# Altium schematic sheet Level_Shifter.SchDoc
size A; DrawnBy: TIMKEN; SheetNumber: 3; SheetTotal: 7
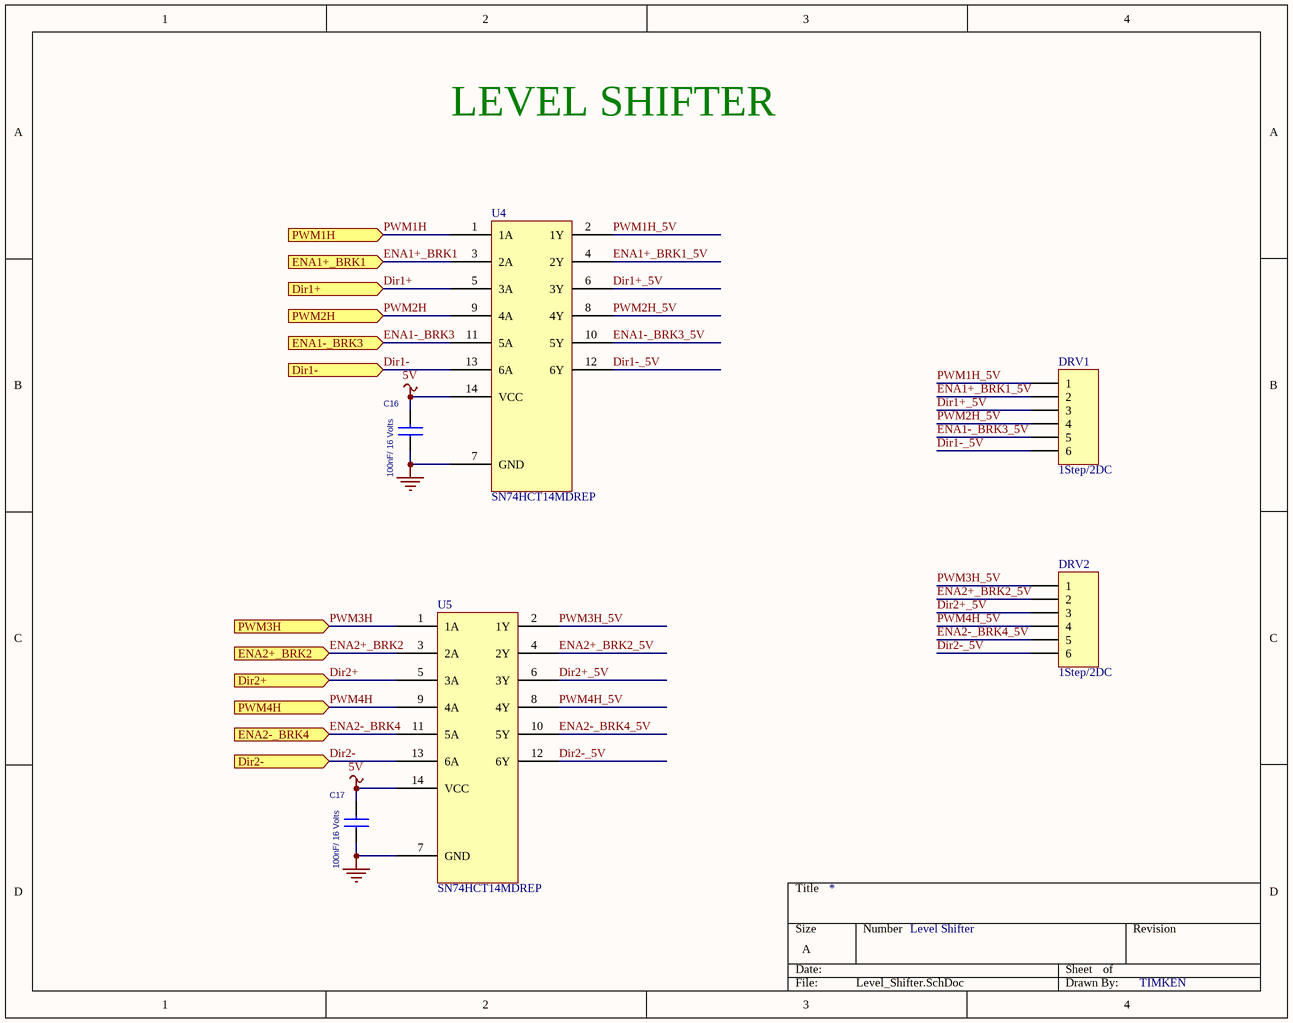
[diagram p0: Level_Shifter.SchDoc]

## Parts
C16  100nF/ 16 Volts  [CAP_CERAMIC]
C17  100nF/ 16 Volts  [CAP_CERAMIC]
DRV1  1Step/2DC  [1x6_single]
DRV2  1Step/2DC  [1x6_single]
U4  SN74HCT14MDREP  [SN74HCT14MDREP]
U5  SN74HCT14MDREP  [SN74HCT14MDREP]

## Ports
Dir1+ (in), Dir1- (in), Dir2+ (in), Dir2- (in), ENA1+_BRK1 (in), ENA1-_BRK3 (in), ENA2+_BRK2 (in), ENA2-_BRK4 (in), PWM1H (in), PWM2H (in), PWM3H (in), PWM4H (in)

## Nets
5V: C16.2 C17.2 U4.14(VCC) U5.14(VCC)
GND_POWER: C16.1 C17.1 U4.7(GND) U5.7(GND)
Dir1+: U4.5(3A) ; port Dir1+
Dir1+_5V: DRV1.3 U4.6(3Y)
Dir1-: U4.13(6A) ; port Dir1-
Dir1-_5V: DRV1.6 U4.12(6Y)
Dir2+: U5.5(3A) ; port Dir2+
Dir2+_5V: DRV2.3 U5.6(3Y)
Dir2-: U5.13(6A) ; port Dir2-
Dir2-_5V: DRV2.6 U5.12(6Y)
ENA1+_BRK1: U4.3(2A) ; port ENA1+_BRK1
ENA1+_BRK1_5V: DRV1.2 U4.4(2Y)
ENA1-_BRK3: U4.11(5A) ; port ENA1-_BRK3
ENA1-_BRK3_5V: DRV1.5 U4.10(5Y)
ENA2+_BRK2: U5.3(2A) ; port ENA2+_BRK2
ENA2+_BRK2_5V: DRV2.2 U5.4(2Y)
ENA2-_BRK4: U5.11(5A) ; port ENA2-_BRK4
ENA2-_BRK4_5V: DRV2.5 U5.10(5Y)
PWM1H: U4.1(1A) ; port PWM1H
PWM1H_5V: DRV1.1 U4.2(1Y)
PWM2H: U4.9(4A) ; port PWM2H
PWM2H_5V: DRV1.4 U4.8(4Y)
PWM3H: U5.1(1A) ; port PWM3H
PWM3H_5V: DRV2.1 U5.2(1Y)
PWM4H: U5.9(4A) ; port PWM4H
PWM4H_5V: DRV2.4 U5.8(4Y)

## Notes on the sheet
- LEVEL SHIFTER
- Level Shifter

## Library data of the parts
C16 C17 = CAP NP: V P No: 644160RL; Vendor: Farnell; M P No: CC0805KRX7R7BB104; Descr: CAPACITOR, 0805, 100NF, 16V, X7R; FootPrint: C0805
DRV1 DRV2 = Header 6: Header, 6-Pin; LatestRevisionDate: 17-Jul-2002; LatestRevisionNote: Re-released for DXP Platform.; Publisher: Altium Limited
U4 U5 = 74HC153D